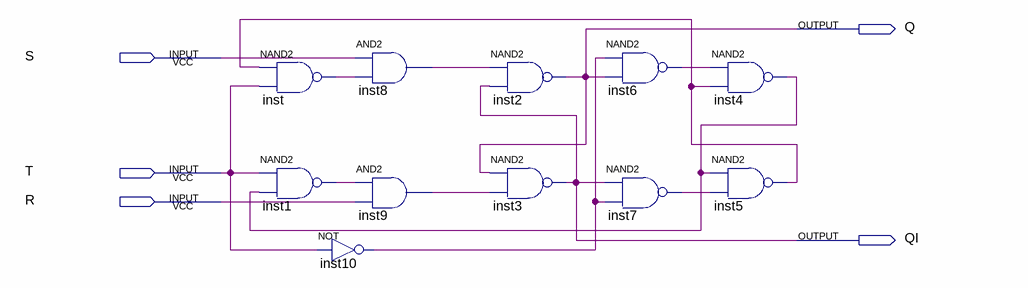
[diagram p0: schematic sheet]
// Quartus schematic point2.bdf as structural Verilog: 11 symbols, 5 pins
module point2 (
  input  S,
  input  T,
  input  R,
  output Q,
  output QI
);

  wire inst1_out, inst4_out, inst5_out, inst6_out, inst7_out, inst8_out, inst9_out, inst10_out, inst_out;

  nand inst (inst_out, inst5_out, T);
  nand inst1 (inst1_out, T, inst4_out);
  not inst10 (inst10_out, T);
  and inst8 (inst8_out, S, inst_out);
  and inst9 (inst9_out, inst1_out, R);
  nand inst2 (Q, inst8_out, QI);
  nand inst3 (QI, Q, inst9_out);
  nand inst6 (inst6_out, inst10_out, Q);
  nand inst7 (inst7_out, QI, inst10_out);
  nand inst4 (inst4_out, inst6_out, inst5_out);
  nand inst5 (inst5_out, inst4_out, inst7_out);
endmodule
